# EAGLE design ATtiny861devbrdtst2 (EAGLE 5.06)
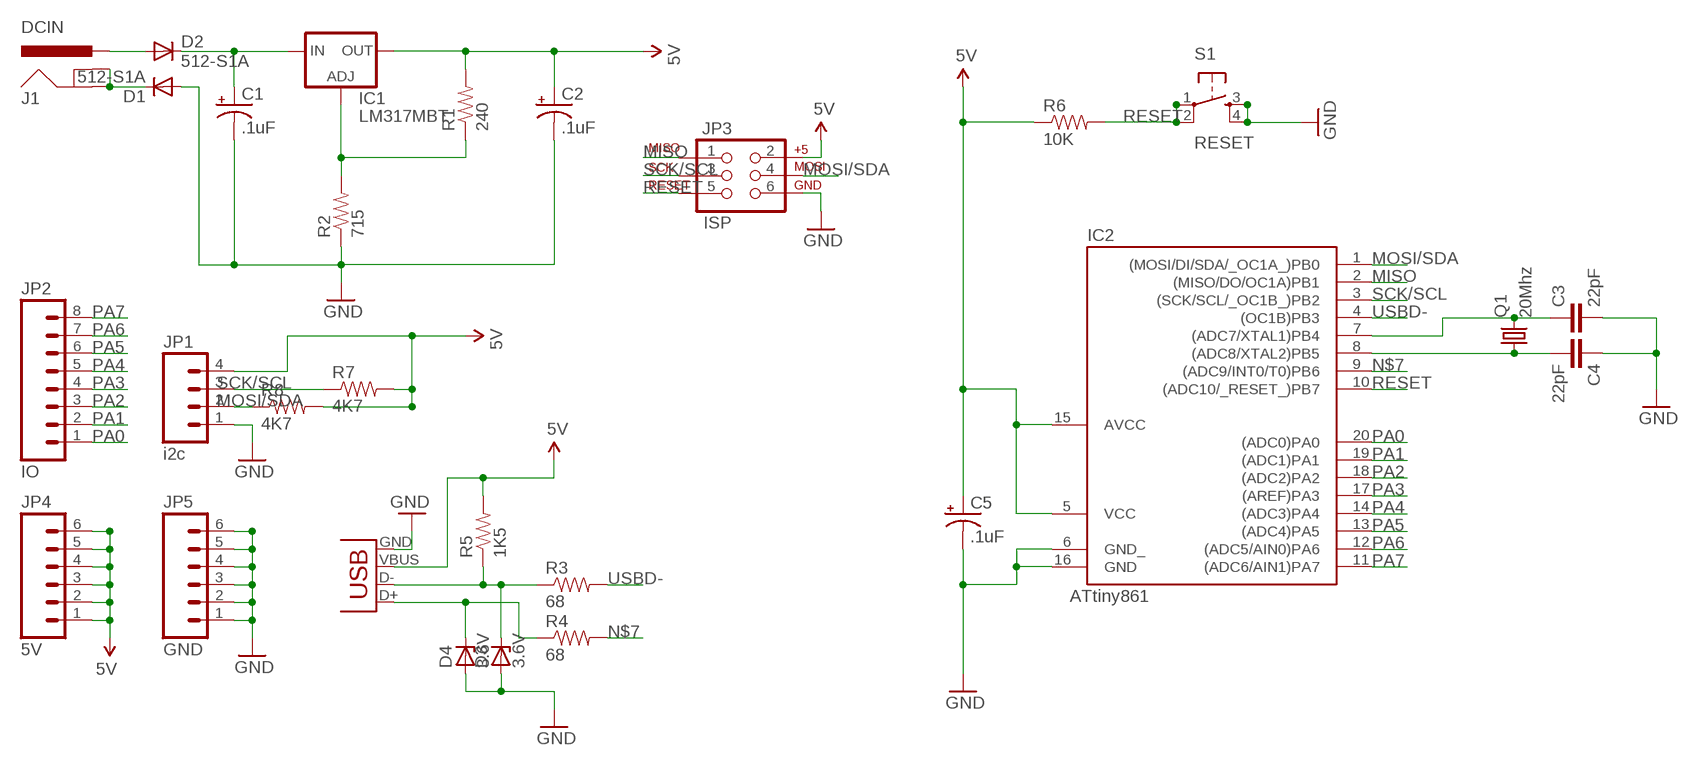
[diagram p0: schematic, sheet 1]

## Parts
C1  .1uF  CAP_POLPTH2  [CPOL-RADIAL-10UF-25V]
C2  .1uF  CAP_POLPTH2  [CPOL-RADIAL-10UF-25V]
C3  22pF  CAPPTH2  [CAP-PTH-SMALL2]
C4  22pF  CAPPTH2  [CAP-PTH-SMALL2]
C5  .1uF  CAP_POLPTH2  [CPOL-RADIAL-10UF-25V]
D1  512-S1A  DIODE1N4148  [DIODE-1N4148]
D2  512-S1A  DIODE1N4148  [DIODE-1N4148]
D3  3.6V  ZTK  [DO35Z10]
D4  3.6V  ZTK  [DO35Z10]
IC1  LM317MBT  [TO220L1]
IC2  ATtiny861  TINY26P  [DIL20]
J1  DCIN  POWER_JACKPTH  [POWER_JACK_PTH]
JP1  i2c  M04PTH  [1X04]
JP2  IO  M08LONGPADS  [1X08_LONGPADS]
JP3  ISP  AVR_SPI_PRG_6PTH  [2X3]
JP4  5V  M06LONGPADS  [1X06_LONGPADS]
JP5  GND  M06LONGPADS  [1X06_LONGPADS]
Q1  20Mhz  CRYSTALHC49UV  [HC49U-V]
R1  240  RESISTORPTH1  [AXIAL-0.3]
R2  715  RESISTORPTH1  [AXIAL-0.3]
R3  68  RESISTORPTH1  [AXIAL-0.3]
R4  68  RESISTORPTH1  [AXIAL-0.3]
R5  1K5  RESISTORPTH1  [AXIAL-0.3]
R6  10K  RESISTORPTH1  [AXIAL-0.3]
R7  4K7  RESISTORPTH1  [AXIAL-0.3]
R8  4K7  RESISTORPTH1  [AXIAL-0.3]
S1  RESET  TAC_SWITCHPTH  [TACTILE-PTH]
X1  USBPTH  [USB-B-PTH]

## Nets
5V: C2.1(+) C5.1(+) IC1.2(OUT) IC2.5(VCC) IC2.15(AVCC) JP1.4 JP3.2 JP4.1 JP4.2 JP4.3 JP4.4 JP4.5 JP4.6 R1.P$2 R5.P$2 R6.P$1 R7.P$2 R8.P$2 X1.VBUS
GND: C1.2(-) C2.2(-) C3.2 C4.1 C5.2(-) D1.A D3.A D4.A IC2.6(GND_) IC2.16(GND) JP1.1 JP3.6 JP5.1 JP5.2 JP5.3 JP5.4 JP5.5 JP5.6 R2.P$1 S1.3 S1.4 X1.GND
MISO: IC2.2((MISO/DO/OC1A)PB1) JP3.1
MOSI/SDA: IC2.1((MOSI/DI/SDA/_OC1A_)PB0) JP1.2 JP3.4 R8.P$1
N$1: D2.A J1.PWR
N$2: C1.1(+) D2.C IC1.3(IN)
N$3: D1.C J1.GND J1.GNDBREAK
N$5: D3.C R3.P$1 R5.P$1 X1.D-
N$6: IC1.1(ADJ) R1.P$1 R2.P$2
N$7: IC2.9((ADC9/INT0/T0)PB6) R4.P$2
N$8: C3.1 IC2.7((ADC7/XTAL1)PB4) Q1.2
N$9: D4.C R4.P$1 X1.D+
N$10: C4.2 IC2.8((ADC8/XTAL2)PB5) Q1.1
PA0: IC2.20((ADC0)PA0) JP2.1
PA1: IC2.19((ADC1)PA1) JP2.2
PA2: IC2.18((ADC2)PA2) JP2.3
PA3: IC2.17((AREF)PA3) JP2.4
PA4: IC2.14((ADC3)PA4) JP2.5
PA5: IC2.13((ADC4)PA5) JP2.6
PA6: IC2.12((ADC5/AIN0)PA6) JP2.7
PA7: IC2.11((ADC6/AIN1)PA7) JP2.8
RESET: IC2.10((ADC10/_RESET_)PB7) JP3.5 R6.P$2 S1.1 S1.2
SCK/SCL: IC2.3((SCK/SCL/_OC1B_)PB2) JP1.3 JP3.3 R7.P$1
USBD-: IC2.4((OC1B)PB3) R3.P$2

## Library data of the parts
C1 C2 C5 = SparkFun-2009-11-03:CAP_POL: Capacitor Polarized These are standard SMD and PTH capacitors. Normally 10uF, 47uF, and 100uF in electrolytic and tantalum varieties. Always verify the external diameter of the through hole cap, it varies with capacity, voltage, and manufacturer. The EIA devices should be standard.
C3 C4 = SparkFun-2009-11-03:CAP: Capacitor Standard 0603 ceramic capacitor, and 0.1" leaded capacitor.
D1 D2 = SparkFun-2009-11-03:DIODE: Diode These are standard reverse protection diodes and small signal diodes. SMA package can handle up to about 1A. SOD-323 can handle about 200mA. What the SOD-323 package when ordering, there are some mfgs out there that are 5-pin packages.
D3 D4 = diode:ZTK: Z DIODE
IC1 = v-reg:LM317?*: 500 mA Adjustable Output Positive Voltage Regulator Source: http://www.onsemi.co.jp .. LM317M-D.PDF
IC2 = avr-6:TINY26: Atmel Tiny26/261/461/861
J1 = SparkFun-2009-11-03:POWER_JACK: Power Jack This is the standard 5.5mm barrel jack for power. The PTH is the most common, proven, reliable, footprint. All others are experimental. The Slot footprint only works if the mill layer is transmitted to the PCB fab house so be warned. Spark Fun Electronics SKU : PRT-00119. Mating wall wart : TOL-00298 (and others)
JP1 = SparkFun-2009-11-03:M04: Header 4 Standard 4-pin 0.1" header. Use with straight break away headers (SKU : PRT-00116), right angle break away headers (PRT-00553), swiss pins (PRT-00743), machine pins (PRT-00117), and female headers (PRT-00115). Molex polarized connector foot print use with SKU : PRT-08231 with associated crimp pins and housings.
JP2 = SparkFun-2009-11-03:M08: Header 8 Standard 8-pin 0.1" header. Use with straight break away headers (SKU : PRT-00116), right angle break away headers (PRT-00553), swiss pins (PRT-00743), machine pins (PRT-00117), and female headers (PRT-00115).
JP3 = SparkFun-2009-11-03:AVR_SPI_PRG_6: AVR ISP 6 Pin This is the reduced ISP connector for AVR programming. Common on Arduino. This footprint will take up less PCB space and can be used with a 10-pin to 6-pin adapter such as SKU: BOB-08508
JP4 JP5 = SparkFun-2009-11-03:M06: Header 6 Standard 6-pin 0.1" header. Use with straight break away headers (SKU : PRT-00116), right angle break away headers (PRT-00553), swiss pins (PRT-00743), machine pins (PRT-00117), and female headers (PRT-00115). Molex polarized connector foot print use with SKU : PRT-08094 with associated crimp pins and housings. NOTES ON THE VARIANTS LOCK and LOCK_LONGPADS... This footprint was designed to help hold the alignment of a through-hole component (i.e. 6-pin header) while soldering it into place. You may notice that each hole has been shifted either up or down by 0.005 of an inch from it's more standard position (which is a perfectly straight line). This slight alteration caused the pins (the squares in the middle) to touch the edges of the holes. Because they are alternating, it causes a "brace" to hold the component in place. 0.005 has proven to be the perfect amount of "off-center" position when using our standard breakaway headers. Although looks a little odd when you look at the bare footprint, once you have a header in there, the alteration is very hard to notice. Also, if you push a header all the way into place, it is covered up entirely on the bottom side. This idea of altering the position of holes to aid alignment will be further integrated into the Sparkfun Library for other footprints. It can help hold any component with 3 or more connection pins.
Q1 = SparkFun:CRYSTAL: Crystals Various standard crystals. Proven footprints. Spark Fun Electronics SKU : COM-00534
R1-R8 = SparkFun-2009-11-03:RESISTOR: Resistor Basic schematic elements and footprints for 0603, 1206, and PTH 1/10th watt (small) resistors.
S1 = SparkFun-2009-11-03:TAC_SWITCH: Momentary Switch Button commonly used for reset or general input. Spark Fun Electronics SKU : COM-00097
X1 = SparkFun-2009-11-03:USB: USB Connectors USB-B-PTH is fully proven SKU : PRT-00139 USB-miniB is fully proven SKU : PRT-00587 USB-A-PCB is untested. USB-A-H is throughly reviewed, but untested. Spark Fun Electronics SKU : PRT-00437 USB-B-SMT is throughly reviewed, but untested. Needs silkscreen touching up. USB-A-S has not been used/tested USB-MB-H has not been used/tested

## Board
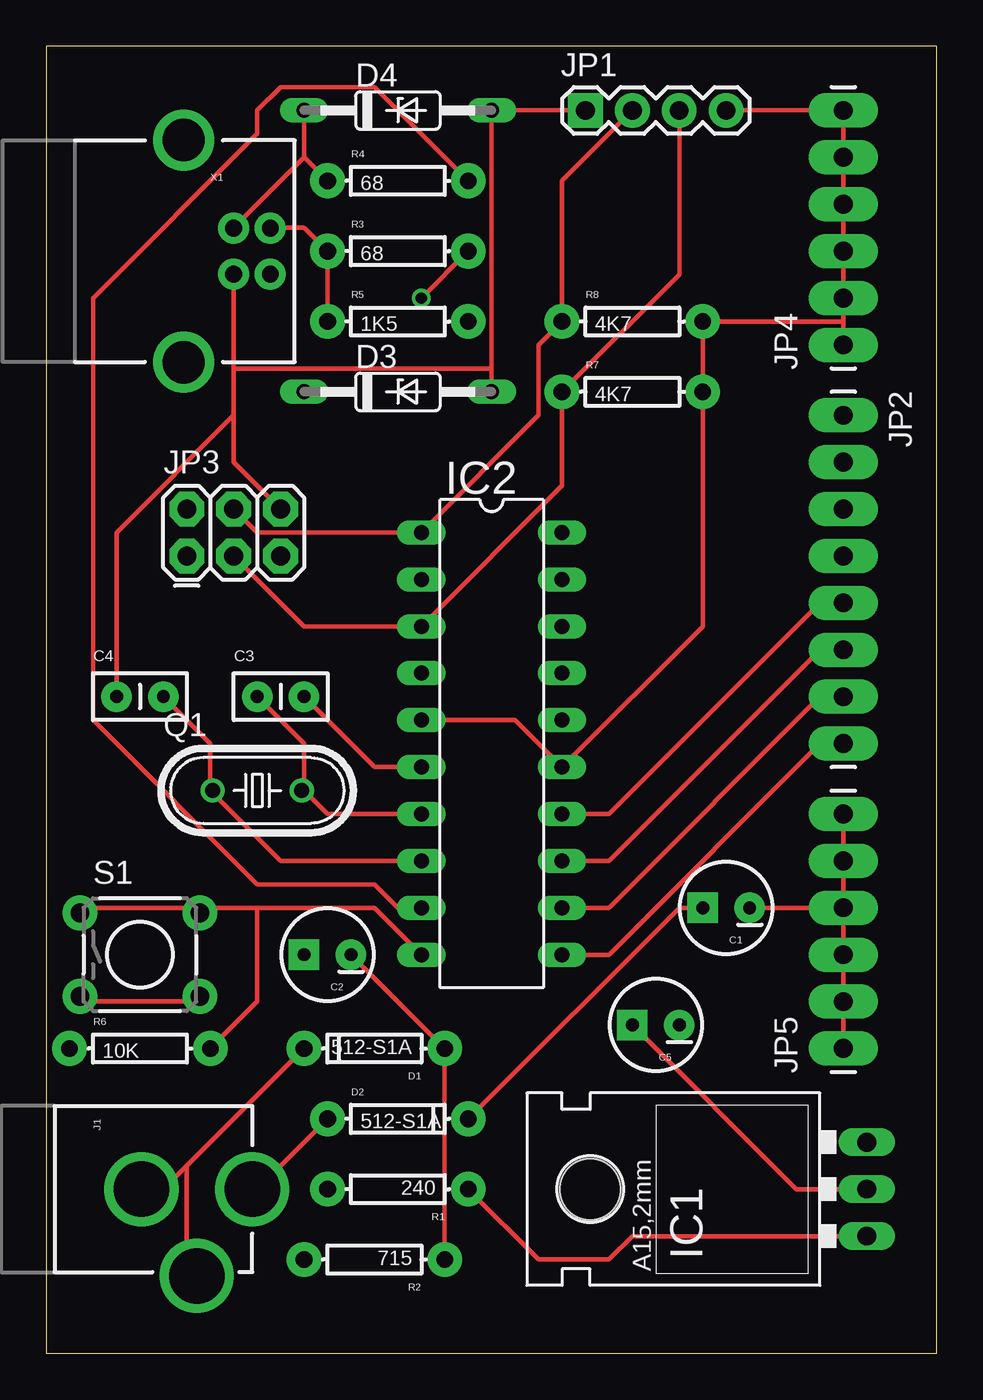
[diagram p1: board, top side]
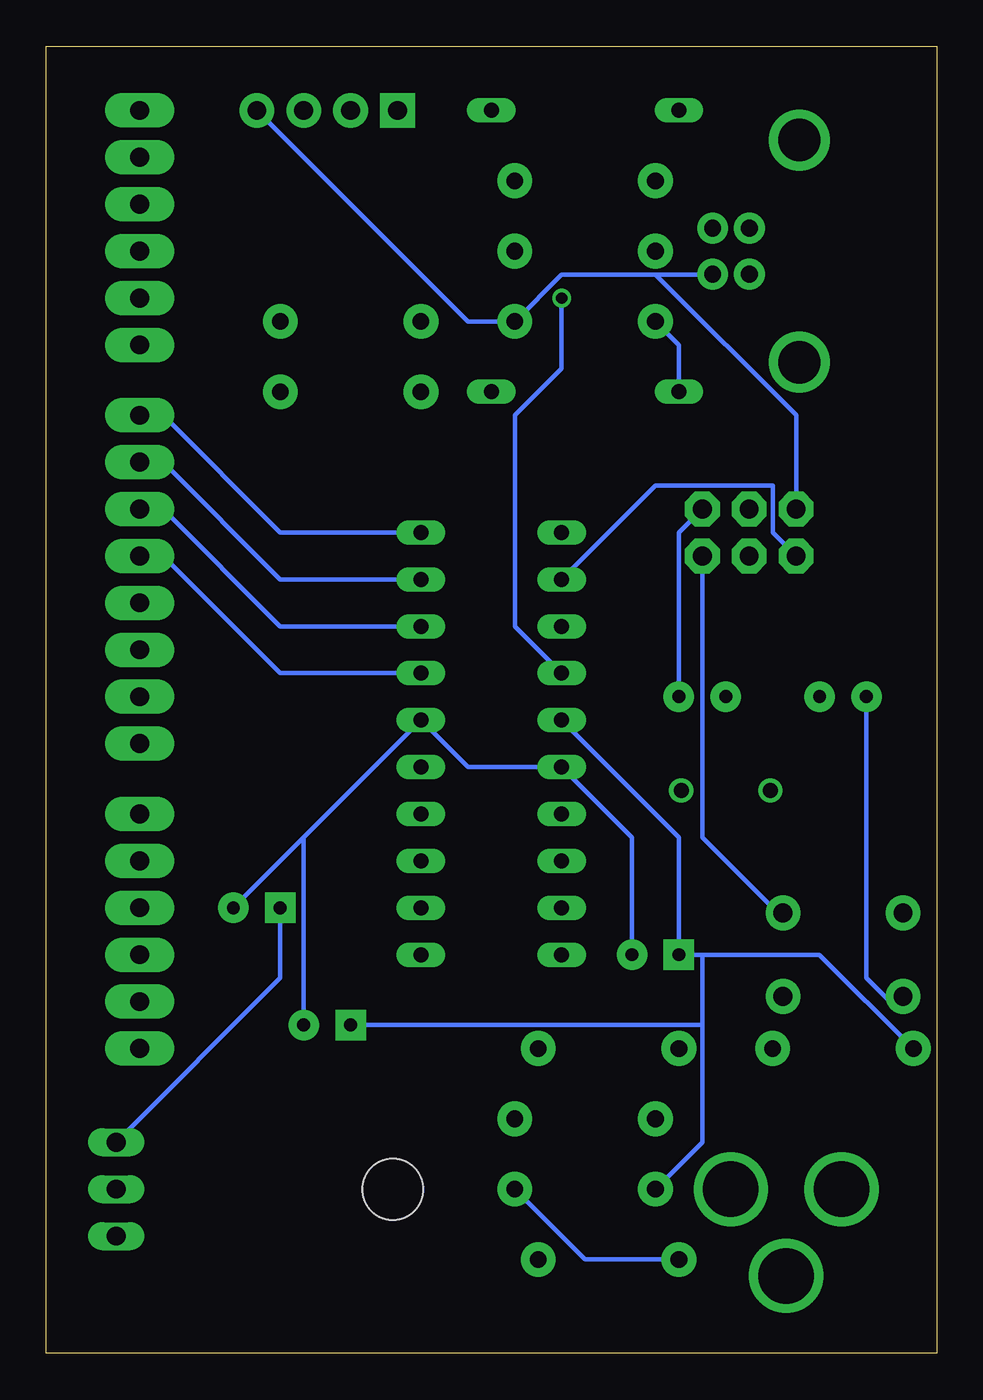
[diagram p2: board, bottom side, seen from below]

Size 48.24 x 70.79 mm. Coordinates in mm from the lower left corner, seen from the top.
Outline: 0,0 48.24,0 48.24,70.79 0,70.79 0,0
Copper layers (1*16): Top 0.035mm / dielectric 1.5mm / Bottom 0.035mm
Design rules "default": minimum track width 10mil, minimum drill 24mil, track to track 8mil, track to pad 8mil, pad to pad 8mil, via to via 8mil, smd to smd 8mil, copper to edge 40mil, drill to drill 8mil, minimum pad ring 10mil, minimum via ring 8mil, stop-mask expansion 4mil, vias tented up to drill 0mil, thermal gap 10mil

### Footprints (pad centres in the part's own frame; a part is rotated, then mirrored left to right if it is on the bottom)
CPOL-RADIAL-10UF-25V = drill 0.7 pad 1.651 square: 1 1.27,0 | drill 0.7 pad 1.651 round: 2 -1.27,0
CAP-PTH-SMALL2 = drill 0.7 pad 1.651 round: 1 0,0; 2 2.54,0
DIODE-1N4148 = drill 0.9 pad 1.88 round: A -3.81,0; C 3.81,0
DO35Z10 = drill 0.813 long: A 5.08,0; C -5.08,0
TO220L1 = drill 1.016 long: 1 -2.54,-3.81; 2 0,-3.81; 3 2.54,-3.81 | hole 3.302: 0,11.176
DIL20 = drill 0.813 long: 1 -11.43,-3.81; 2 -8.89,-3.81; 3 -6.35,-3.81; 4 -3.81,-3.81; 5 -1.27,-3.81; 6 1.27,-3.81; 7 3.81,-3.81; 8 6.35,-3.81; 9 8.89,-3.81; 10 11.43,-3.81; 11 11.43,3.81; 12 8.89,3.81; 13 6.35,3.81; 14 3.81,3.81; 15 1.27,3.81; 16 -1.27,3.81; 17 -3.81,3.81; 18 -6.35,3.81; 19 -8.89,3.81; 20 -11.43,3.81
POWER_JACK_PTH = drill 2.997 round: GND 0,7.7; GNDBREAK 4.7,10.7; PWR 0,13.7
1X04 = drill 1.016 pad 1.88 square: 1 0,0 | drill 1.016 pad 1.88 round: 2 2.54,0; 3 5.08,0; 4 7.62,0
1X08_LONGPADS = drill 1.016 pad 1.88 long: 1 0,0; 2 2.54,0; 3 5.08,0; 4 7.62,0; 5 10.16,0; 6 12.7,0; 7 15.24,0; 8 17.78,0
2X3 = drill 1.016 pad 1.88 octagon: 1 0,0; 2 0,2.54; 3 2.54,0; 4 2.54,2.54; 5 5.08,0; 6 5.08,2.54
1X06_LONGPADS = drill 1.016 pad 1.88 long: 1 0,0; 2 2.54,0; 3 5.08,0; 4 7.62,0; 5 10.16,0; 6 12.7,0
HC49U-V = drill 0.813 round: 1 -2.413,0; 2 2.413,0
AXIAL-0.3 = drill 0.9 pad 1.88 round: P$1 -3.81,0; P$2 3.81,0
TACTILE-PTH = drill 1.016 pad 1.88 round: 1 -3.251,2.261; 2 3.251,2.261; 3 -3.251,-2.261; 4 3.251,-2.261
USB-B-PTH = drill 0.914 pad 1.676 round: D+ 0,1.25; D- 1.981,1.25; GND 0,-1.25; VBUS 1.981,-1.25 | drill 2.286 round: P$1 -2.718,-6.02; P$2 -2.718,6.02

### Placement (x,y rotation side)
C1  36.83,24.13 180 top
C2  15.24,21.59 180 top
C3  11.43,35.56 0 top
C4  3.81,35.56 0 top
C5  33.02,17.78 180 top
D1  17.78,16.51 180 top
D2  19.05,12.7 0 top
D3  19.05,52.07 0 top
D4  19.05,67.31 0 top
IC1  40.64,8.89 90 top
IC2  24.13,33.02 270 top
J1  -2.54,8.89 270 top
JP1  29.21,67.31 0 top
JP2  43.18,50.8 270 top
JP3  7.62,43.18 0 top
JP4  43.18,54.61 90 top
JP5  43.18,16.51 90 top
Q1  11.43,30.48 0 top
R1  19.05,8.89 180 top
R2  17.78,5.08 180 top
R3  19.05,59.69 0 top
R4  19.05,63.5 0 top
R5  19.05,55.88 0 top
R6  5.08,16.51 0 top
R7  31.75,52.07 0 top
R8  31.75,55.88 0 top
S1  5.08,21.59 0 top
X1  10.16,59.69 0 top

### Tracks (layer width: path | path; a pad name or v marks a point on that pad's centre or on a via)
5V
  Top 0.254: JP1.4 JP4.6 JP4.5 JP4.4 JP4.3 JP4.2 43.18,55.88 | 43.18,55.88 JP4.1 | 43.18,55.88 R8.P$2 R7.P$2 35.56,39.37 IC2.15 25.4,34.29 IC2.5 | IC1.2 40.64,8.89 C5.1
  Bottom 0.254: 15.24,58.42 20.32,58.42 R5.P$2 25.4,55.88 JP1.4 | 15.24,58.42 12.7,58.42 X1.VBUS | JP3.2 7.62,50.8 15.24,58.42 | 12.7,21.59 6.35,21.59 R6.P$1 | 12.7,21.59 C2.1 13.97,27.94 IC2.5 | R1.P$2 12.7,11.43 12.7,17.78 | 12.7,21.59 12.7,17.78 | 12.7,17.78 C5.1
GND
  Top 0.254: C2.2 D1.A R2.P$1 | JP5.6 JP5.5 JP5.4 | JP5.1 JP5.2 JP5.3 JP5.4 | IC2.6 17.78,31.75 C3.2 | C1.2 JP5.4 | S1.4 7.62,19.05 2.54,19.05 S1.3 | 10.16,50.8 10.16,48.26 JP3.6 | 10.16,50.8 10.16,53.34 | 10.16,53.34 X1.GND | 24.13,53.34 D4.A JP1.1 | 24.13,53.34 D3.A | 10.16,53.34 24.13,53.34 | C4.1 3.81,44.45 10.16,50.8
  Bottom 0.254: 34.29,27.94 C1.2 | 34.29,27.94 IC2.16 25.4,31.75 IC2.6 16.51,27.94 C2.2 | 34.29,27.94 C5.2 | C4.1 3.81,20.32 2.54,19.05 S1.3 | C3.2 13.97,44.45 JP3.6
MISO
  Bottom 0.254: IC2.2 15.24,46.99 8.89,46.99 8.89,44.45 JP3.1
MOSI/SDA
  Top 0.254: JP3.4 11.43,44.45 IC2.1 26.67,50.8 26.67,54.61 R8.P$1 27.94,63.5 JP1.2
N$1
  Top 0.254: D2.A 11.43,8.89 J1.PWR
N$2
  Top 0.254: D2.C 34.29,24.13 C1.1
  Bottom 0.254: IC1.3 35.56,20.32 C1.1
N$3
  Top 0.254: 7.62,10.16 6.35,8.89 J1.GND | 7.62,10.16 D1.C | 7.62,10.16 7.62,5.08 J1.GNDBREAK
N$5
  Top 0.254: X1.D- 12.7,60.96 13.97,60.96 R3.P$1 R5.P$1
  Bottom 0.254: D3.C 13.97,54.61 R5.P$1
N$6
  Top 0.254: IC1.1 31.75,6.35 30.48,5.08 26.67,5.08 R1.P$1
  Bottom 0.254: R2.P$2 19.05,5.08 R1.P$1
N$7
  Top 0.254: IC2.9 19.05,24.13 17.78,25.4 11.43,25.4 2.54,34.29 2.54,57.15 11.43,66.04 11.43,67.31 12.7,68.58 17.78,68.58 R4.P$2
N$8
  Top 0.254: 13.97,30.48 13.97,33.02 C3.1 | IC2.7 15.24,29.21 13.97,30.48 | Q1.2 13.97,30.48
N$9
  Top 0.254: 13.97,64.77 D4.C | 13.97,64.77 R4.P$1 | 13.97,64.77 10.16,60.96 X1.D+
N$10
  Top 0.254: 8.89,30.48 8.89,33.02 C4.2 | IC2.8 12.7,26.67 8.89,30.48 | Q1.1 8.89,30.48
PA0
  Bottom 0.254: IC2.20 35.56,44.45 41.91,50.8 JP2.1
PA1
  Bottom 0.254: IC2.19 35.56,41.91 41.91,48.26 JP2.2
PA2
  Bottom 0.254: IC2.18 35.56,39.37 41.91,45.72 JP2.3
PA3
  Bottom 0.254: IC2.17 35.56,36.83 41.91,43.18 JP2.4
PA4
  Top 0.254: IC2.14 30.48,29.21 41.91,40.64 JP2.5
PA5
  Top 0.254: IC2.13 30.48,26.67 41.91,38.1 JP2.6
PA6
  Top 0.254: IC2.12 30.48,24.13 41.91,35.56 JP2.7
PA7
  Top 0.254: IC2.11 30.48,21.59 41.91,33.02 JP2.8
RESET
  Top 0.254: IC2.10 17.78,24.13 11.43,24.13 | 11.43,24.13 8.89,24.13 S1.2 7.62,24.13 2.54,24.13 S1.1 | R6.P$2 11.43,19.05 11.43,24.13
  Bottom 0.254: JP3.5 12.7,27.94 8.89,24.13 S1.2
SCK/SCL
  Top 0.254: JP3.3 13.97,39.37 IC2.3 27.94,46.99 R7.P$1 34.29,58.42 JP1.3
USBD-  (via drill 0.61)
  Top 0.254: v20.32,57.15 R3.P$2
  Bottom 0.254: IC2.4 22.86,39.37 22.86,50.8 20.32,53.34 v20.32,57.15